# Altium schematic sheet Sensors.SchDoc
size A4; SheetNumber: 2; SheetTotal: 4
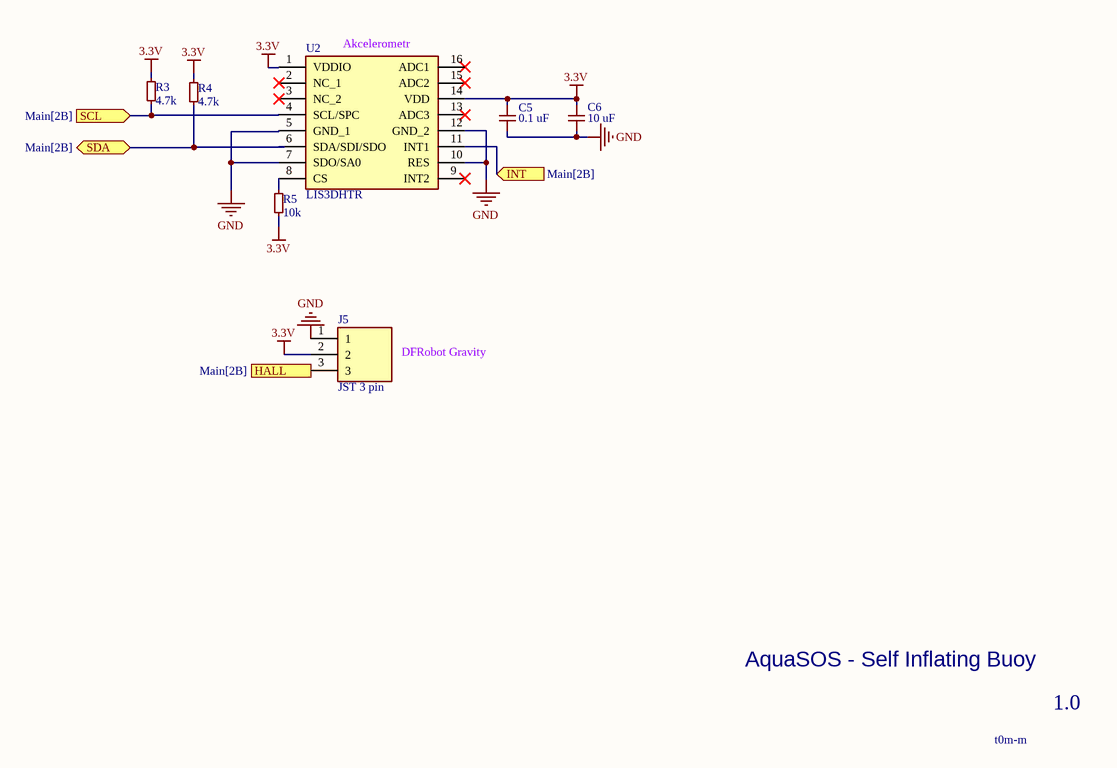
[diagram p0: Sensors.SchDoc]

## Parts
C5  0.1 uF  [MLASU105SB7104KFNB25]
C6  10 uF  [KGM05CS60J106MH]
J5  JST 3 pin  [S3B-PH-K-S]
R3  4.7k  [CRCW040210K0FKEDC]
R4  4.7k  [CRCW040210K0FKEDC]
R5  10k  [CRCW040210K0FKEDC]
U2  LIS3DHTR  [LIS3DHTR]

## Ports
HALL (see Main[2B]), INT (in, see Main[2B]), SCL (in, see Main[2B]), SDA (bidir, see Main[2B])

## Nets
3.3V: C5.1 C6.1 J5.2 R3.1 R4.2 R5.2 U2.1(VDDIO) U2.14(VDD)
GND: C5.2 C6.2 J5.1 U2.5(GND_1) U2.7(SDO/SA0) U2.10(RES) U2.12(GND_2)
HALL: J5.3 ; port HALL
INT: U2.11(INT1) ; port INT
SCL: R3.2 U2.4(SCL/SPC) ; port SCL
SDA: R4.1 U2.6(SDA/SDI/SDO) ; port SDA
NetR5_1: R5.1 U2.8(CS)

Not connected (* = marked no-connect by the designer): U2 2(NC_1)* 3(NC_2)* 9(INT2)* 13(ADC3)* 15(ADC2)* 16(ADC1)*

## Notes on the sheet
- (near U2) Akcelerometr
- DFRobot Gravity
- AquaSOS - Self Inflating Buoy
- 1.0
- t0m-m

## Library data of the parts
C5 = MLASU105SB7104KFNB25: 0.1uF Capacitor
C6 = KGM05CS60J106MH: 10 uF Capacitor
J5 = JST 3 pin: JST 3 pin connector
R3 R4 = RC0402FR-7D4K7L: 4.7k 0402 resistor
R5 = CRCW040210K0FKEDC: 10k 0402 Resistor
U2 = LIS3DHTR: Accelerometer 3-Axis 2g/16g 1.8V LGA16 STMicroelectronics LIS3DHTR Accelerometer IC, 3-axis, I2C, SPI 1.71  3.6 V, 16-Pin LGA; Geometry.Height: 1mm; Mouser Part Number: 511-LIS3DHTR; Mouser Price/Stock: https://www.mouser.co.uk/ProductDetail/STMicroelectronics/LIS3DHTR?qs=6la6oa3D8xzhXYax3cEo4w%3D%3D; Manufacturer_Name: STMicroelectronics; Manufacturer_Part_Number: LIS3DHTR; Datasheet Link: https://www.st.com/resource/en/datasheet/lis3dh.pdf